# EAGLE design v1 (EAGLE 8.3.2)
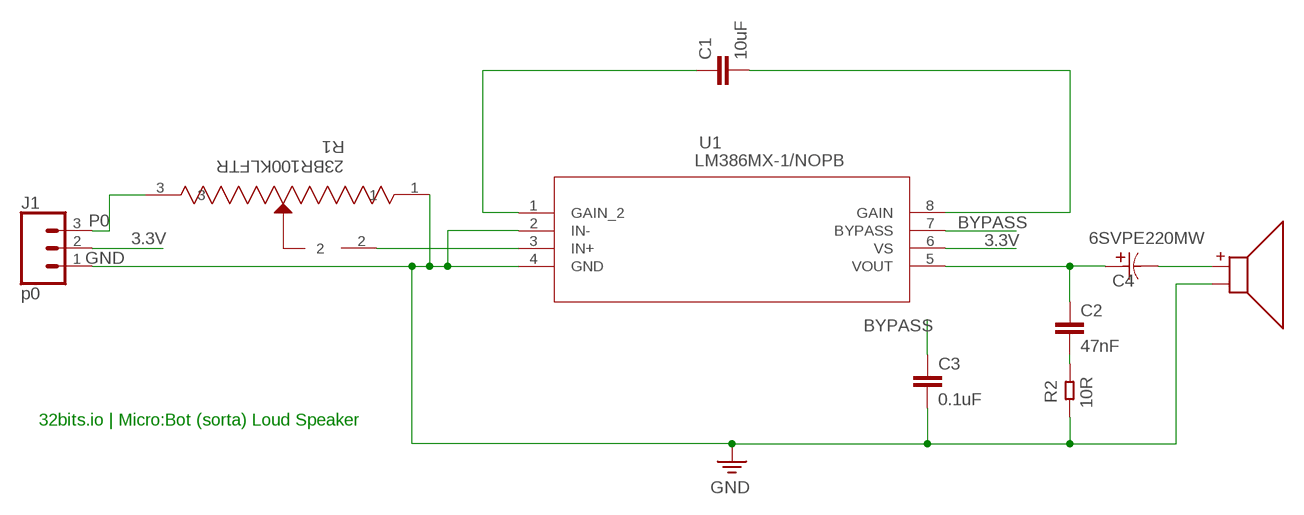
[diagram p0: schematic, sheet 1]

## Parts
C1  10uF  10UF-0603-6.3V-20%  [0603]
C2  47nF  47NF-0603-25V-5%  [0603]
C3  0.1uF  0.1UF-0603-25V-(+80/-20%)  [0603]
C4  6SVPE220MW  [PCAP_SVP_B6]
J1  p0  CONN_03SMD_RA_MALE  [1X03_SMD_RA_MALE]
R1  23BR100KLFTR  [SOT_23BR100KLFTR]
R2  10R  SMD-RES-0R-5%-1/10W(0603)  [R0603]
U1  LM386MX-1/NOPB  [M08A]
U$1  SMS-1308MS-2-R  [SMS-1308MS-2-R]

## Nets
3.3V: J1.2 U1.6(VS)
+: C4.2 U$1.+
BYPASS: C3.1 U1.7(BYPASS)
GAIN: C1.2 U1.8(GAIN)
GND: C3.2 J1.1 R1.1 R2.1 U1.2(IN-) U1.4(GND) U$1.-
IN+: R1.2 U1.3(IN+)
N$1: C2.2 R2.2
N$2: C1.1 U1.1(GAIN_2)
P0: J1.3 R1.3
VOUT: C2.1 C4.1 U1.5(VOUT)

## Notes on the sheet
- 32bits.io | Micro:Bot (sorta) Loud Speaker

## Library data of the parts
C1 = SparkFun-Capacitors:10UF: 10.0µF ceramic capacitors A capacitor is a passive two-terminal electrical component used to store electrical energy temporarily in an electric field.; PROD_ID: CAP-11015
C2 = SparkFun-Capacitors:47NF: 47nF ceramic capacitors A capacitor is a passive two-terminal electrical component used to store electrical energy temporarily in an electric field.; PROD_ID: CAP-08605
C3 = SparkFun-Capacitors:0.1UF: 0.1µF ceramic capacitors A capacitor is a passive two-terminal electrical component used to store electrical energy temporarily in an electric field.; PROD_ID: CAP-00810
C4 = BuzzerLib:6SVPE220MW; MANUFACTURER_PART_NUMBER: 6SVPE220MW; VENDOR: Panasonic
J1 = SparkFun-Connectors:CONN_03: Multi connection point. Often used as Generic Header-pin footprint for 0.1 inch spaced/style header connections On any of the 0.1 inch spaced packages, you can populate with these: Break Away Headers - Straight <https://www.sparkfun.com/products/116> (PRT-00116) Break Away Male Headers - Right Angle <https://www.sparkfun.com/products/553> (PRT-00553) Female Headers <https://www.sparkfun.com/products/115> (PRT-00115) Break Away Headers - Machine Pin <https://www.sparkfun.com/products/117> (PRT-00117) Break Away Female Headers - Swiss Machine Pin <https://www.sparkfun.com/products/743> (PRT-00743) Stackable Header - 3 Pin (Female, 0.1") <https://www.sparkfun.com/products/13875> (PRT-13875) For SCREWTERMINALS and SPRING TERMINALS visit here: Screw Terimnals on SparkFun.com <https://www.sparkfun.com/search/results?term=Screw+Terminals> (5mm/3.5mm/2.54mm spacing) This device is also useful as a general connection point to wire up your design to another part of your project. Our various solder wires solder well into these plated through hole pads. Hook-Up Wire - Assortment (Stranded, 22 AWG) <https://www.sparkfun.com/products/11375> (PRT-11375) Hook-Up Wire - Assortment (Solid Core, 22 AWG) <https://www.sparkfun.com/products/11367> (PRT-11367) View the entire wire category on our website here <https://www.sparkfun.com/categories/141> Special notes: Molex polarized connector foot print use with SKU : PRT-08232 with associated crimp pins and housings.; PROD_ID: CONN-10925
R1 = BuzzerLib:23BR100KLFTR; MANUFACTURER_PART_NUMBER: 23BR100KLFTR; VENDOR: Bi Technologies
R2 = Seeed-Resistor:SMD-RES-0R-5%-1/10W(0603): 301010292; MPN: RC0603JR-070RL; VALUE: 0R
U1 = BuzzerLib:LM386MX-1/NOPB; MANUFACTURER_PART_NUMBER: LM386MX1NOPB; VENDOR: Texas Instruments
U$1 = BuzzerLib:SMS-1308MS-2-R: PUI Audio SMD Speaker Kapton cone with LCP housing. .7W (1W max) 8 Ohm.

## Board
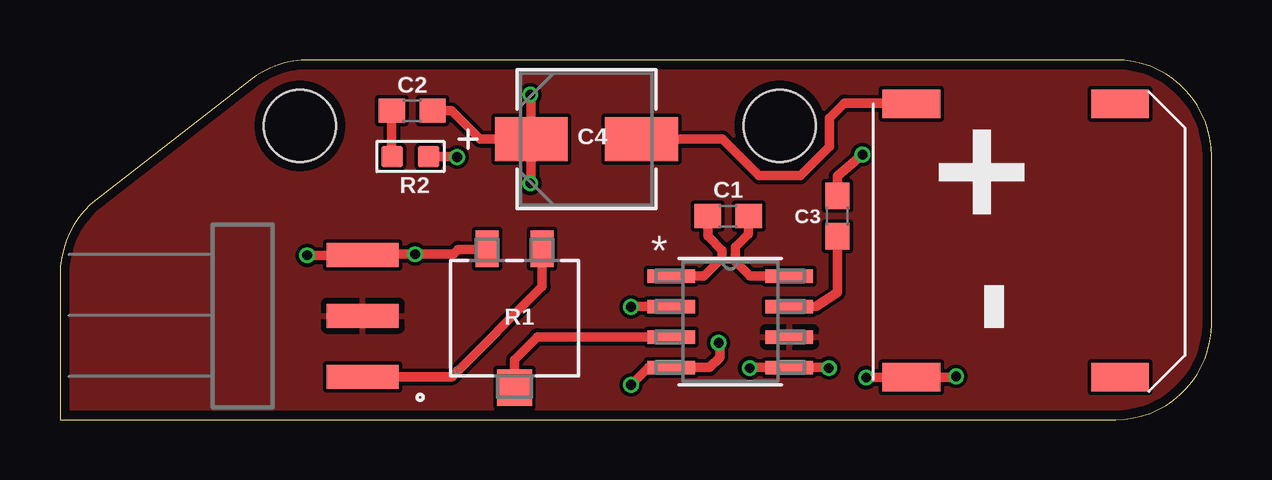
[diagram p1: board, top side]
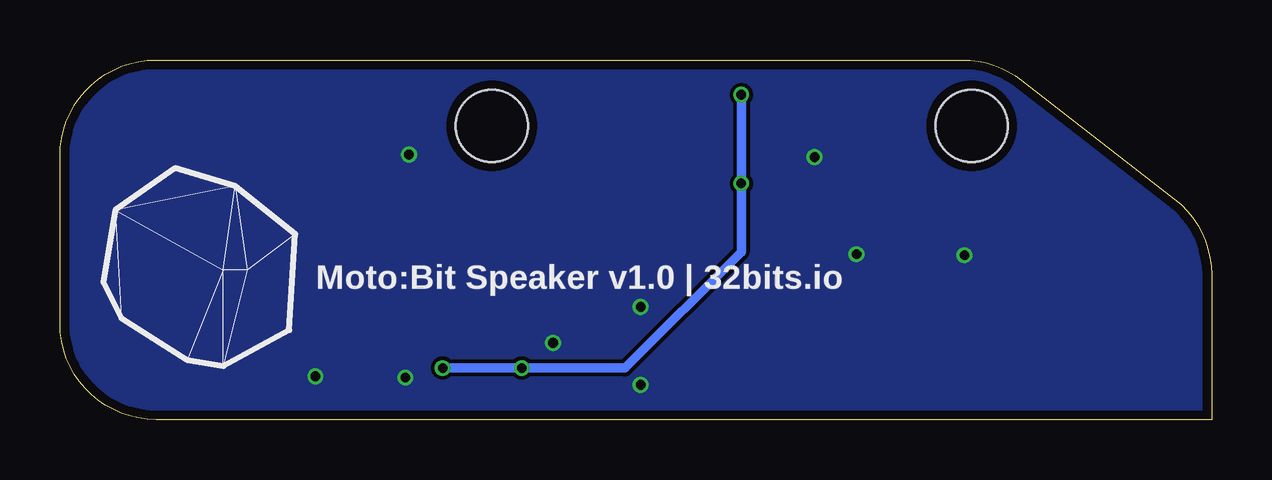
[diagram p2: board, bottom side, seen from below]

Size 48 x 15 mm. Coordinates in mm from the lower left corner, seen from the top.
Outline: 0,0 44,0 arc90 48,4 48,11 arc90 44,15 10.37,15 arc38 7.92,14.16 1.54,9.2 arc52 0,6.04 0,0
Copper layers (1*16): Top 0.035559375mm / dielectric 1.6mm / Bottom 0.035559375mm
Design rules "oshpark-2layer-tented": minimum track width 6mil, minimum drill 10mil, track to track 6mil, track to pad 6mil, pad to pad 6mil, via to via 6mil, smd to smd 6mil, copper to edge 15mil, drill to drill 6mil, minimum pad ring 5mil, minimum via ring 5mil, stop-mask expansion 2.5mil, vias tented up to drill 20mil, thermal gap 10mil
Holes 3 mm at 30,12.25 10,12.25

### Footprints (pad centres in the part's own frame; a part is rotated, then mirrored left to right if it is on the bottom)
0603 = smd 1.1 x 1: 1 -0.85,0; 2 0.85,0
PCAP_SVP_B6 = smd 3.023 x 1.829: 1 -2.299,0; 2 2.299,0
1X03_SMD_RA_MALE = smd 1 x 3: 1 -2.54,5; 2 0,5; 3 2.54,5
SOT_23BR100KLFTR = smd 0.965 x 1.524: 1 -1.143,2.896; 3 1.143,2.896 | smd 1.473 x 1.524: 2 0,-2.896
R0603 = smd 0.889 x 0.889: 1 0,0.762; 2 0,-0.762
M08A = smd 1.981 x 0.559: 1 -2.464,1.905; 2 -2.464,0.635; 3 -2.464,-0.635; 4 -2.464,-1.905; 5 2.464,-1.905; 6 2.464,-0.635; 7 2.464,0.635; 8 2.464,1.905
SMS-1308MS-2-R = smd 1.2 x 2.4: + 0.5,1.1; - 11.9,1.1; NC$1 0.5,9.8; NC$2 11.9,9.8

### Placement (x,y rotation side)
C1  27.85,8.48 0 top
C2  14.68,12.88 180 top
C3  32.4,8.49 90 top
C4  21.94,11.7 0 top
J1  7.62,4.33 270 top
R1  18.95,4.23 0 top
R2  14.61,10.97 270 top
U1  27.94,4.08 0 top
U$1  34.39,13.67 270 top
U$2  [32BITS_LOGO]  45,2 0 bottom

### Tracks (layer width: path | path; a pad name or v marks a point on that pad's centre or on a via)
3.3V
  pour Top: -1,16 49,16 49,-1 -1,-1
+
  Top 0.4: C4.2 27.61,11.7 29.14,10.17 30.86,10.17 32.08,11.39 32.08,12.58 32.7,13.2 35.46,13.2 U$1.+
BYPASS
  Top 0.4: U1.7 31.52,4.71 32.4,5.3 C3.1
GAIN
  Top 0.4: C1.2 28.7,7.75 28.15,7.2 28.15,6.6 28.75,6 30.39,6 U1.8
GND  (via drill 0.4)
  Top 0.203: 12.6,6.85 J1.1 12.65,6.9
  Top 0.4: v10.3,6.85 12.6,6.85 12.65,6.9 v14.8,6.9 16.4,6.9 16.6,7.1 17.78,7.1 R1.1 | R2.1 16.53,10.97 v16.55,10.95 | U1.2 23.82,4.71 v23.8,4.7 | C3.2 32.4,10.15 v33.45,11.05 | v33.6,1.75 33.62,1.77 U$1.- 37.32,1.77 v37.35,1.8 | v23.8,1.45 24.52,2.17 U1.4 27.07,2.17 27.5,2.6 27.5,3.15 v27.45,3.2
  pour Bottom: -1,16 49,16 49,-1 -1,-1
IN+
  Top 0.4: R1.2 18.95,2.5 19.9,3.45 U1.3
N$1
  Top 0.4: C2.2 13.83,10.99 R2.2
N$2
  Top 0.4: U1.1 26.84,5.99 27.6,6.75 27.6,7.05 27,7.65 C1.1
P0
  Top 0.4: J1.3 16.34,1.79 20.1,5.55 20.1,7.12 R1.3
VOUT  (via drill 0.4)
  Top 0.4: C2.1 16.32,12.88 17.5,11.7 C4.1 | C4.1 19.64,13.46 v19.6,13.55 | C4.1 19.64,9.89 v19.6,9.85 | v28.75,2.15 28.77,2.17 U1.5 32.02,2.17 v32.05,2.15
  Bottom 0.4: v19.6,9.85 19.55,9.9 | v19.6,9.85 19.6,7 24.45,2.15 v28.75,2.15 v32.05,2.15 | v19.6,13.55 v19.6,9.85

### Text on the board
bPlace: Moto:Bit Speaker v1.0 | 32bits.io